# EAGLE design GW0015.v1.r02 (EAGLE 5.08)
MFGN: Tyco; MFGP: 9-103324-0
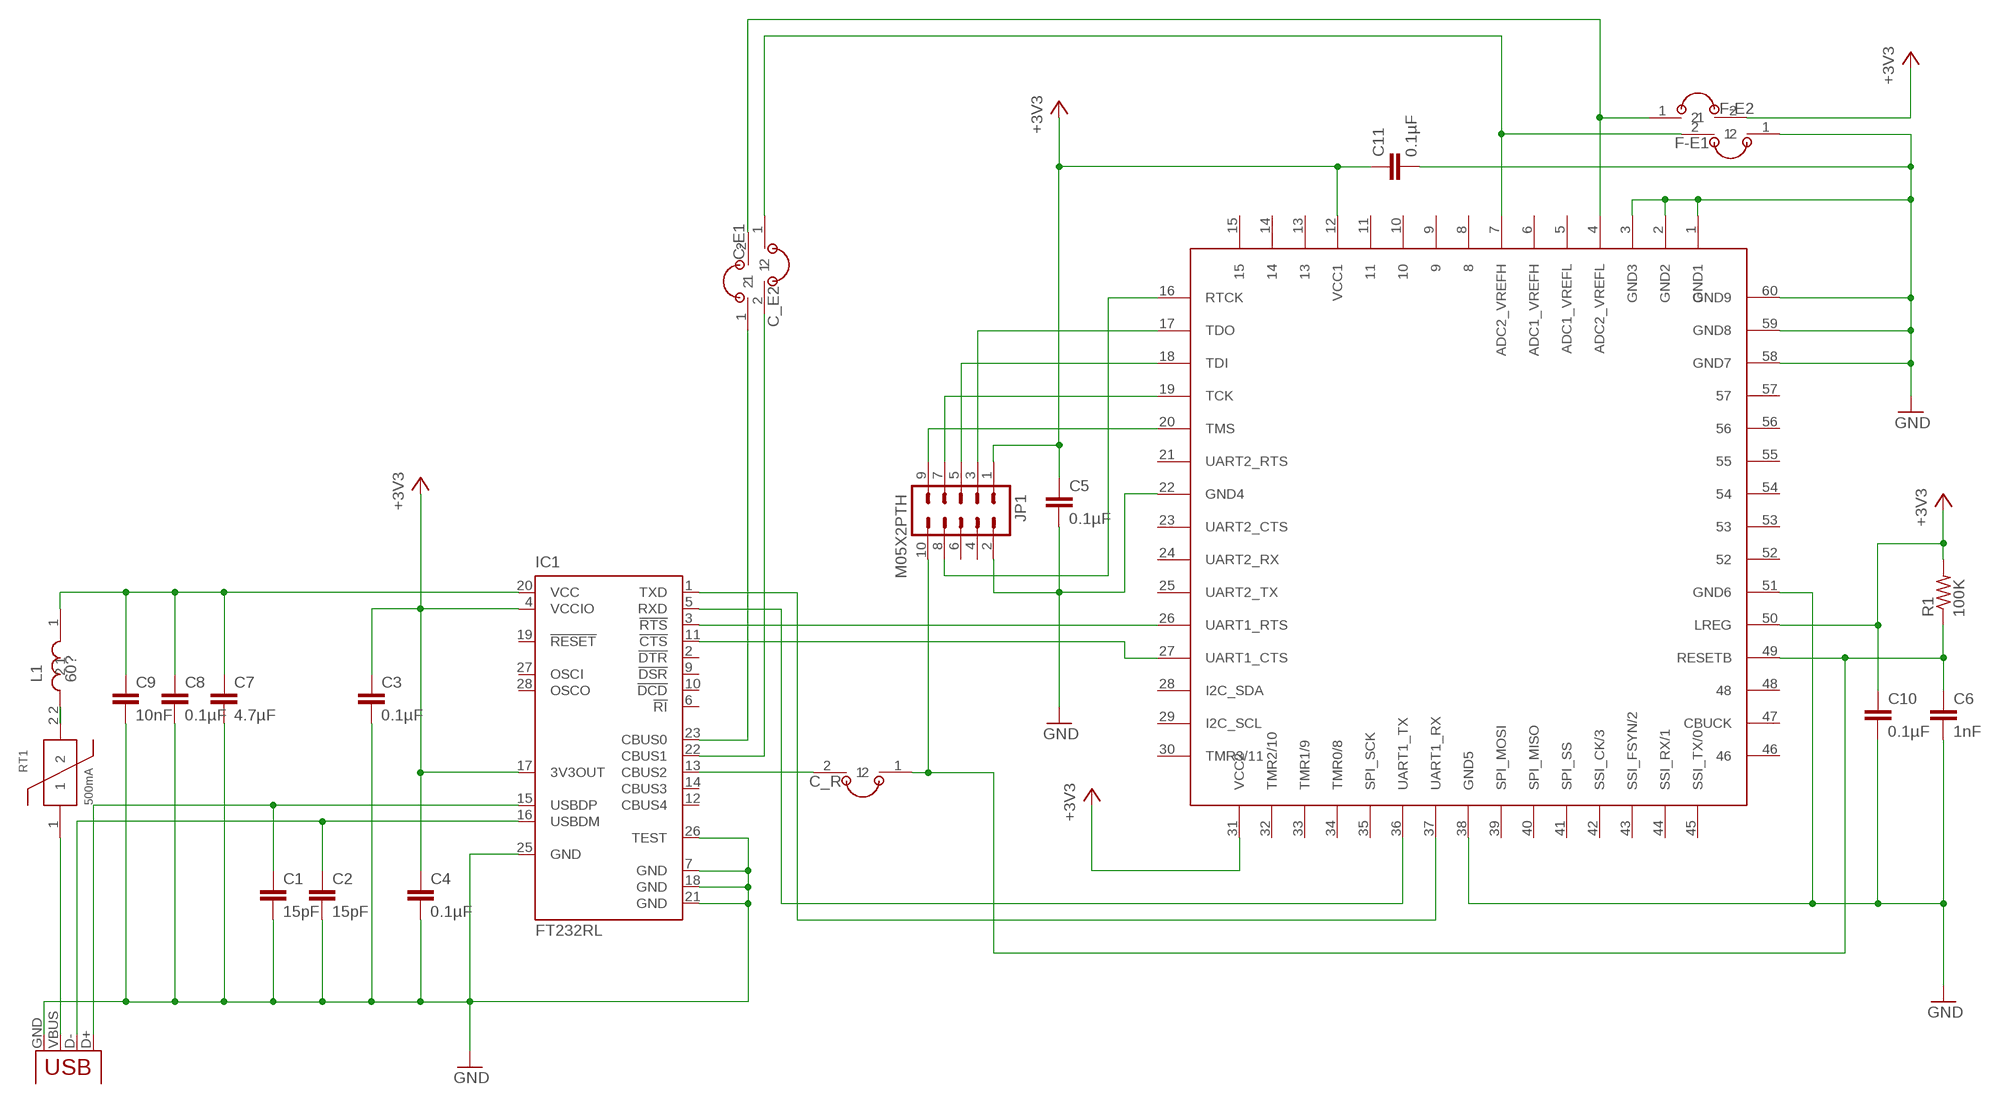
[diagram p0: schematic, sheet 1]

## Parts
C1  15pF  RF-C0402  [RF-C0402]
C2  15pF  RF-C0402  [RF-C0402]
C3  0.1µF  RF-C0402  [RF-C0402]
C4  0.1µF  RF-C0402  [RF-C0402]
C5  0.1µF  RF-C0402  [RF-C0402]
C6  1nF  RF-C0402  [RF-C0402]
C7  4.7µF  RF-C0805  [RF-C0805]
C8  0.1µF  RF-C0402  [RF-C0402]
C9  10nF  RF-C0402  [RF-C0402]
C10  0.1µF  RF-C0402  [RF-C0402]
C11  0.1µF  RF-C0402  [RF-C0402]
C-E1  JUMPER-2X-SMT-VIA  [JUMPER-VIA-2X]
C_E2  JUMPER-2X-SMT-VIA  [JUMPER-VIA-2X]
C_R  JUMPER-2X-SMT-VIA  [JUMPER-VIA-2X]
F-E1  JUMPER-2X-SMT-VIA  [JUMPER-VIA-2X]
F-E2  JUMPER-2X-SMT-VIA  [JUMPER-VIA-2X]
IC1  FT232RL  [SSOP28]
JP1  M05X2PTH  [AVR_ICSP]
L1  60?  RF-L0603  [RF-L0603]
R1  100K  RF-R0402  [RF-R0402]
RT1  500mA  SMD050F  [C1210]
U$1  ZSFM201-1A  [ZSFM201-1]
X1  USBPTH  [USB-B-PTH]

## Nets
+3V3: C3.1 C4.1 C5.1 C10.1 C11.1 F-E2.2 IC1.4(VCCIO) IC1.17(3V3OUT) JP1.1 R1.2 U$1.12(VCC1) U$1.31(VCC2) U$1.50(LREG)
GND [GND]: C1.2 C2.2 C3.2 C4.2 C5.2 C6.2 C7.2 C8.2 C9.2 C10.2 C11.2 F-E1.1 IC1.7(GND) IC1.18(GND) IC1.21(GND) IC1.25(GND) IC1.26(TEST) JP1.2 U$1.1(GND1) U$1.2(GND2) U$1.3(GND3) U$1.22(GND4) U$1.38(GND5) U$1.51(GND6) U$1.58(GND7) U$1.59(GND8) U$1.60(GND9) X1.GND
MCU_CTS: IC1.11(!CTS) U$1.27(UART1_CTS)
MCU_RTS: IC1.3(!RTS) U$1.26(UART1_RTS)
MCU_RX: IC1.1(TXD) U$1.37(UART1_RX)
MCU_TX: IC1.5(RXD) U$1.36(UART1_TX)
N$9: C-E1.2 F-E2.1 U$1.4(ADC2_VREFL)
N$10: C_E2.1 F-E1.2 U$1.7(ADC2_VREFH)
N$11: C-E1.1 IC1.23(CBUS0)
N$12: C_E2.2 IC1.22(CBUS1)
N$19: C_R.2 IC1.13(CBUS2)
RESET: C6.1 C_R.1 JP1.10 R1.1 U$1.49(RESETB)
RTCK: JP1.8 U$1.16(RTCK)
TCK: JP1.7 U$1.19(TCK)
TDI: JP1.5 U$1.18(TDI)
TDO: JP1.3 U$1.17(TDO)
TMS: JP1.9 U$1.20(TMS)
USB+: C1.1 IC1.15(USBDP) X1.D+
USB-: C2.1 IC1.16(USBDM) X1.D-
USB_VCC_1 [USB_VCC]: RT1.1 X1.VBUS
USB_VCC_2 [USB_VCC]: L1.2 RT1.2
USB_VCC_3 [USB_VCC]: C7.1 C8.1 C9.1 IC1.20(VCC) L1.1
Unconnected: IC1.2(!DTR) IC1.6(!RI) IC1.9(!DSR) IC1.10(!DCD) IC1.12(CBUS4) IC1.14(CBUS3) IC1.19(!RESET) IC1.27(OSCI) IC1.28(OSCO) JP1.4 JP1.6 U$1.5(ADC1_VREFL) U$1.6(ADC1_VREFH) U$1.8 U$1.9 U$1.10 U$1.11 U$1.13 U$1.14 U$1.15 U$1.21(UART2_RTS) U$1.23(UART2_CTS) U$1.24(UART2_RX) U$1.25(UART2_TX) U$1.28(I2C_SDA) U$1.29(I2C_SCL) U$1.30(TMR3/11) U$1.32(TMR2/10) U$1.33(TMR1/9) U$1.34(TMR0/8) U$1.35(SPI_SCK) U$1.39(SPI_MOSI) U$1.40(SPI_MISO) U$1.41(SPI_SS) U$1.42(SSI_CK/3) U$1.43(SSI_FSYN/2) U$1.44(SSI_RX/1) U$1.45(SSI_TX/0) U$1.46 U$1.47(CBUCK) U$1.48 U$1.52 U$1.53 U$1.54 U$1.55 U$1.56 U$1.57

## Library data of the parts
C1-C11 = GW-devices:RF-C: RF capacitor pads for FSL reference design
C-E1 C_E2 C_R F-E1 F-E2 = GW-devices:JUMPER-2X: This kind of jumper provides a place to place to put "green wires" for jumpering fetaure/options.
IC1 = ftdichip:FT232R: Source: http://www.ftdichip.com/Documents/DataSheets/DS_FT232R_v104.pdf
JP1 = SparkFun:M05X2: Header 5x2 Standard 10-pin dual row 0.1" header. Commonly used with AVR-ISP. Use with Spark Fun Electronics SKU: PRT-00778
L1 = GW-devices:RF-L: RF inductor pads for FSL reference design
R1 = GW-devices:RF-R: RF resistor pads for FSL reference design
RT1 = GW-devices:SMD050F: Tyco current limit switch
U$1 = GW-devices:ZSFM201-1: The CEL MC13224V
X1 = SparkFun:USB: USB Connectors USB-B-PTH is fully proven SKU : PRT-00139 USB-miniB is fully proven SKU : PRT-00587 USB-A-PCB is untested. USB-A-H is throughly reviewed, but untested. Spark Fun Electronics SKU : PRT-00437 USB-B-SMT is throughly reviewed, but untested. Needs silkscreen touching up. USB-A-S has not been used/tested USB-MB-H has not been used/tested

## Net classes
1 USB_VCC: width 0.4 mm
2 GND: width 0.3 mm

## Board
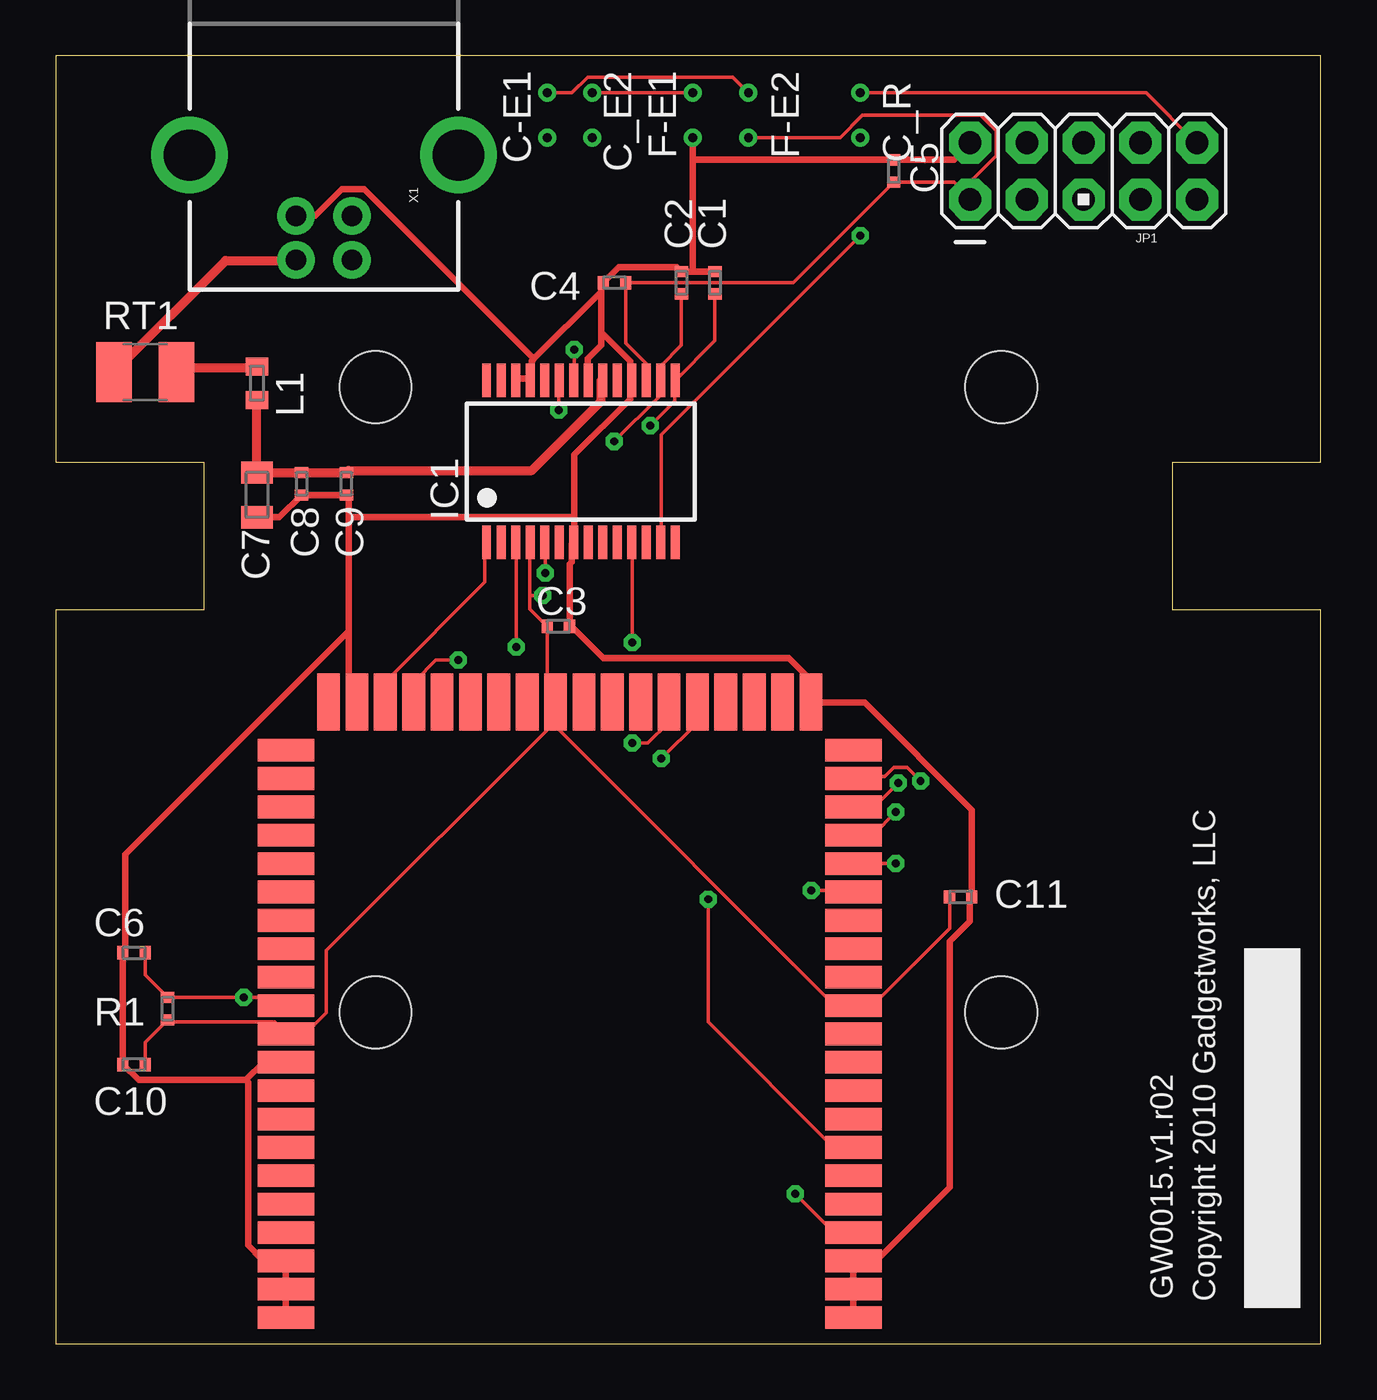
[diagram p1: board, top side]
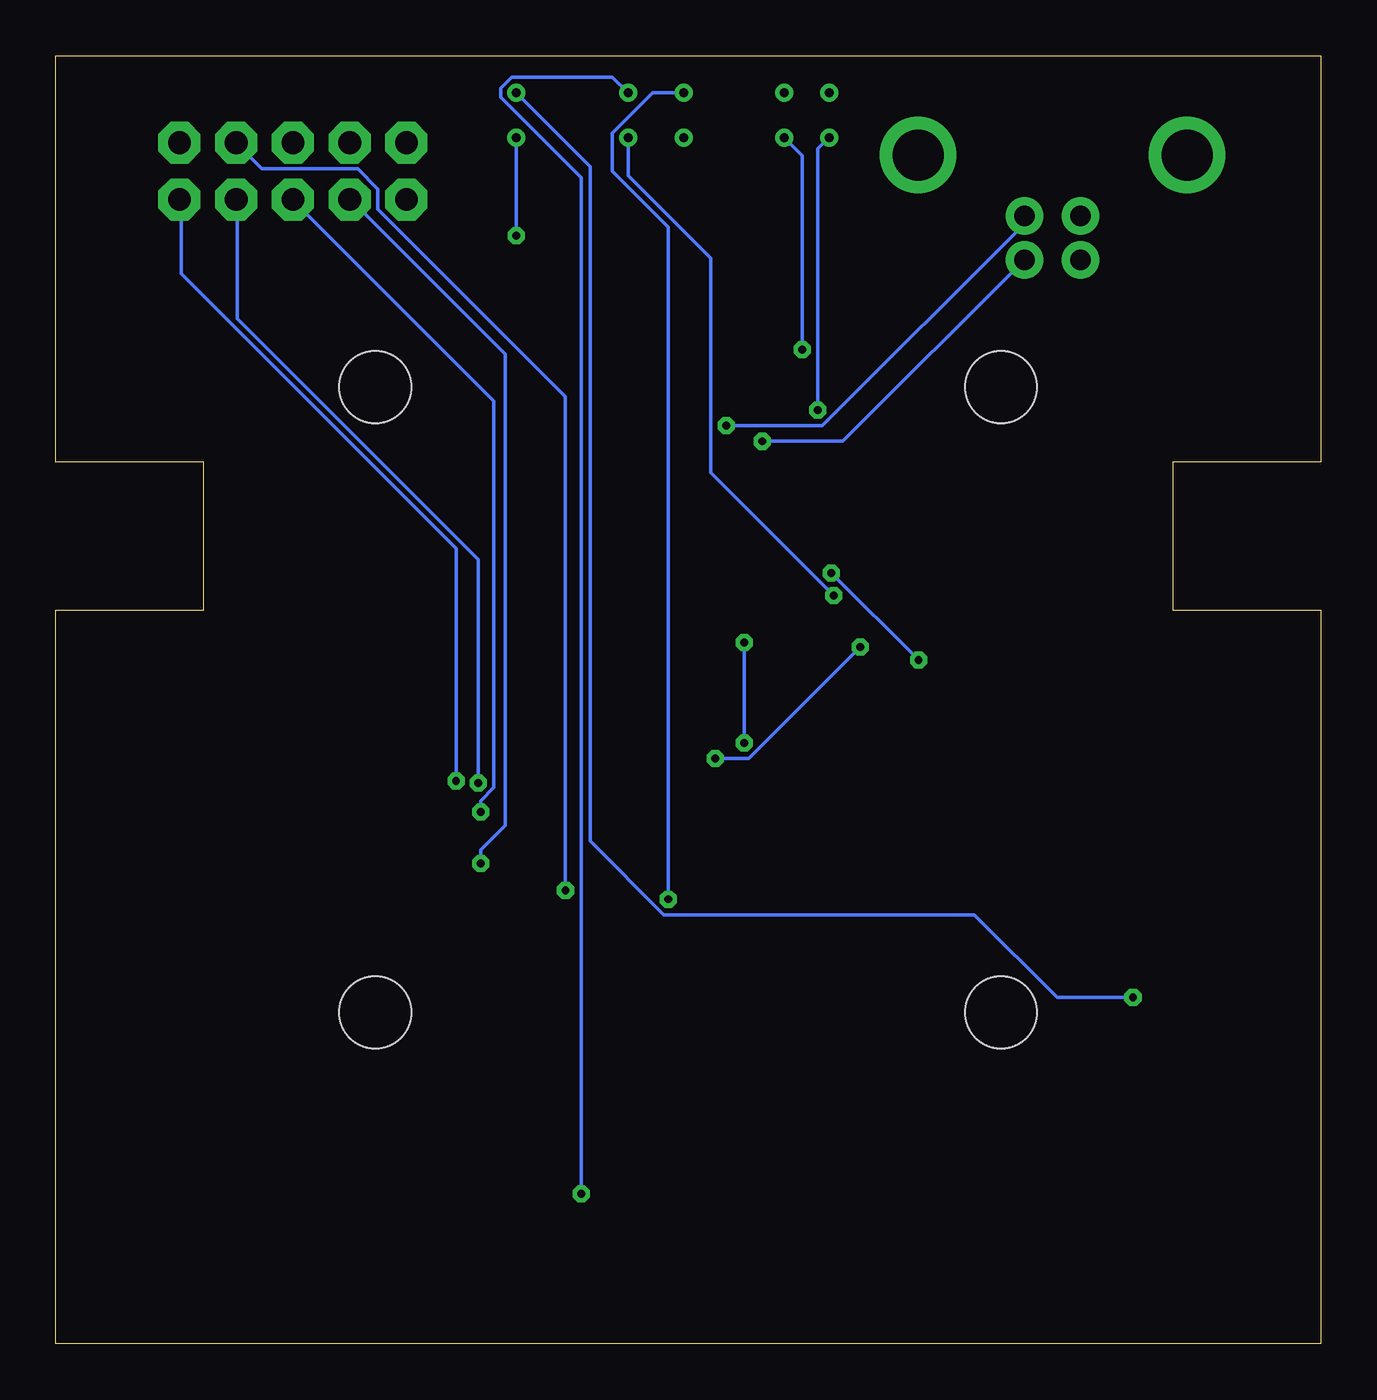
[diagram p2: board, bottom side, seen from below]

Size 56.61 x 57.66 mm. Coordinates in mm from the lower left corner, seen from the top.
Outline: 0,0 56.61,0 56.61,32.85 49.99,32.85 49.99,39.48 56.61,39.48 56.61,57.66 0,57.66 0,39.48 6.62,39.48 6.62,32.85 0,32.85 0,0
Copper layers (1*16): Top 0.0178mm / dielectric 1.4986mm / Bottom 0.0178mm
Design rules "SSC-EAGLE-2Lyr_v1.0.0.3": minimum track width 6mil, minimum drill 14mil, track to track 6mil, track to pad 6mil, pad to pad 6mil, via to via 6mil, smd to smd 6mil, copper to edge 20mil, drill to drill 16mil, minimum pad ring 8mil, minimum via ring 8mil, stop-mask expansion 3mil, vias tented up to drill 0mil, thermal gap 10mil
Holes 3.2 mm at 14.31,14.83 14.31,42.83 42.31,42.83 42.31,14.83

### Footprints (pad centres in the part's own frame; a part is rotated, then mirrored left to right if it is on the bottom)
RF-C0402 = smd 0.5 x 0.6: 1 -0.5,0; 2 0.5,0
RF-C0805 = smd 1 x 1.4: 1 -1,0; 2 1,0
JUMPER-VIA-2X = drill 0.4 round: 1 -1,0; 2 1,0
SSOP28 = smd 0.4 x 1.5: 1 -4.225,-3.625; 2 -3.575,-3.625; 3 -2.925,-3.625; 4 -2.275,-3.625; 5 -1.625,-3.625; 6 -0.975,-3.625; 7 -0.325,-3.625; 8 0.325,-3.625; 9 0.975,-3.625; 10 1.625,-3.625; 11 2.275,-3.625; 12 2.925,-3.625; 13 3.575,-3.625; 14 4.225,-3.625; 15 4.225,3.625; 16 3.575,3.625; 17 2.925,3.625; 18 2.275,3.625; 19 1.625,3.625; 20 0.975,3.625; 21 0.325,3.625; 22 -0.325,3.625; 23 -0.975,3.625; 24 -1.625,3.625; 25 -2.275,3.625; 26 -2.925,3.625; 27 -3.575,3.625; 28 -4.225,3.625
AVR_ICSP = drill 1.016 pad 1.88 octagon: 1 -1.27,5.08; 2 1.27,5.08; 3 -1.27,2.54; 4 1.27,2.54; 5 -1.27,0; 6 1.27,0; 7 -1.27,-2.54; 8 1.27,-2.54; 9 -1.27,-5.08; 10 1.27,-5.08
RF-L0603 = smd 0.8 x 1: 1 -0.75,0; 2 0.75,0
RF-R0402 = smd 0.5 x 0.6: 1 -0.5,0; 2 0.5,0
C1210 = smd 1.6 x 2.7: 1 -1.4,0; 2 1.4,0
ZSFM201-1 = smd 2.54 x 1.016: 1 -12.7,28.829; 2 -12.7,27.559; 3 -12.7,26.289; 4 -12.7,25.019; 5 -12.7,23.749; 6 -12.7,22.479; 7 -12.7,21.209; 8 -12.7,19.939; 9 -12.7,18.669; 10 -12.7,17.399; 11 -12.7,16.129; 12 -12.7,14.859; 13 -12.7,13.589; 14 -12.7,12.319; 15 -12.7,11.049; 16 -12.7,9.779; 17 -12.7,8.509; 18 -12.7,7.239; 19 -12.7,5.969; 20 -12.7,4.699; 21 -12.7,3.429; 40 12.7,3.429; 41 12.7,4.699; 42 12.7,5.969; 43 12.7,7.239; 44 12.7,8.509; 45 12.7,9.779; 46 12.7,11.049; 47 12.7,12.319; 48 12.7,13.589; 49 12.7,14.859; 50 12.7,16.129; 51 12.7,17.399; 52 12.7,18.669; 53 12.7,19.939; 54 12.7,21.209; 55 12.7,22.479; 56 12.7,23.749; 57 12.7,25.019; 58 12.7,26.289; 59 12.7,27.559; 60 12.7,28.829 | smd 1.016 x 2.54: 22 -10.795,1.27; 23 -9.525,1.27; 24 -8.255,1.27; 25 -6.985,1.27; 26 -5.715,1.27; 27 -4.445,1.27; 28 -3.175,1.27; 29 -1.905,1.27; 30 -0.635,1.27; 31 0.635,1.27; 32 1.905,1.27; 33 3.175,1.27; 34 4.445,1.27; 35 5.715,1.27; 36 6.985,1.27; 37 8.255,1.27; 38 9.525,1.27; 39 10.795,1.27
USB-B-PTH = drill 0.914 pad 1.676 round: D+ 0,1.25; D- 1.981,1.25; GND 0,-1.25; VBUS 1.981,-1.25 | drill 2.286 round: P$1 -2.718,-6.02; P$2 -2.718,6.02

### Placement (x,y rotation side)
C1  29.5,47.5 90 top
C2  28,47.5 90 top
C3  22.49,32.12 0 top
C4  25,47.5 180 top
C5  37.5,52.5 90 top
C6  3.5,17.5 180 top
C7  9,38 270 top
C8  11,38.5 270 top
C9  13,38.5 270 top
C10  3.5,12.5 180 top
C11  40.5,20 0 top
C-E1  22,55 90 top
C_E2  24,55 270 top
C_R  36,55 270 top
F-E1  28.5,55 90 top
F-E2  31,55 270 top
IC1  23.5,39.5 0 top
JP1  46,52.5 90 top
L1  9,43 90 top
R1  5,15 270 top
RT1  4,43.5 0 top
U$1  23,30 180 top
X1  12,50.5 270 top

### Tracks (layer width: path | path; a pad name or v marks a point on that pad's centre or on a via)
+3V3  (via drill 0.36)
  Top 0.152: IC1.17 26.4,43.2 26.4,43.9 25.5,44.8 C4.1 33,47.5 C5.1 40.2,52 40.9,51.3 JP1.1 40.6,51.7 42.1,53.2 42.1,54.3 41.4,55 36.1,55 35.1,54 F-E2.2 | C11.1 40,18.6 36.6,15.2 35.7,15.2 | C10.1 4,13.5 R1.2 5,14.4 9.8,14.4 10.3,13.9 U$1.50 10.3,14 11.3,14 12.1,14.8 12.1,17.6 22.3,27.8 22.3,28.7 U$1.31 | U$1.31 22.3,28.8 22,29.1 22,32.1 C3.1 21.9,32.2 21.2,32.9 21.2,33.5 | 21.2,33.5 21.2,35.8 IC1.4 | 35.7,15.2 34.8,15.2 22.3,27.7 U$1.31 | 35.7,15.2 U$1.12 | 21.2,33.5 v21.8,33.5
  Bottom 0.152: F-E2.2 31,52.3 27.3,48.6 27.3,39 v21.8,33.5
GND
  Top 0.3: U$1.1 U$1.2 U$1.3 35.8,3.8 36.8,3.8 40,7 40,18 40.9,18.9 40.9,19.9 C11.2 41,23.9 36.2,28.7 33.8,28.7 U$1.22 33.7,28.8 33.7,29.8 32.8,30.7 24.5,30.7 23.1,32.1 C3.2 23,32.2 23,34.9 23.1,35 23.1,35.8 IC1.7 23.2,36 23.2,37 | U$1.60 U$1.59 U$1.58 10.2,3.8 9.2,3.8 8.6,4.4 8.6,11.7 8.5,11.8 | 8.5,11.8 3.7,11.8 C10.2 C6.2 3.1,17.6 3.1,21.9 13,31.8 13.1,31.8 | 8.5,11.8 9.3,12.6 U$1.51 | 13.1,31.8 13.1,29.1 13.4,28.8 U$1.38 | 13.1,31.8 13.1,37 | 13.1,37 13.1,37.9 C9.2 C8.2 10,37 C7.2 | JP1.2 40.9,53.7 40.2,53 C5.2 28.5,53 | IC1.26 20.6,43.2 21.2,43.2 IC1.25 21.3,43.3 21.3,44 21.4,44.1 | 28.5,48 C1.2 | 28.5,48 C2.2 27.8,48.2 25.2,48.2 C4.2 24.4,47.4 24.4,47 | 24.4,45.2 24.4,47 | 24.4,45.2 24.4,44.7 23.8,44.1 23.8,43.2 IC1.21 | 24.4,45.2 24.5,45.2 25.7,44 25.7,43.2 IC1.18 25.7,43 25.7,42.3 23.2,39.8 23.2,37 | 28.5,53 F-E1.1 | 28.5,48 28.5,53 | 21.4,44.1 24.3,47 24.4,47 | X1.GND 11.6,50.5 12.8,51.7 13.8,51.7 21.4,44.1 | 13.1,37 23.2,37
MCU_CTS  (via drill 0.36)
  Top 0.152: v25.8,31.4 25.8,35.8 IC1.11 | v25.8,26.9 26.5,26.9 27.4,27.8 27.4,28.7 U$1.27
  Bottom 0.152: v25.8,26.9 v25.8,31.4
MCU_RTS  (via drill 0.36)
  Top 0.152: v20.6,31.2 20.6,35.8 IC1.3 | v27.1,26.2 28.7,27.8 28.7,28.7 U$1.26
  Bottom 0.152: v20.6,31.2 25.6,26.2 v27.1,26.2
MCU_RX
  Top 0.152: IC1.1 19.2,35.8 19.2,34.1 14.8,29.7 14.8,28.8 U$1.37
MCU_TX  (via drill 0.36)
  Top 0.152: v21.9,34.5 21.9,35.8 IC1.5 | v18,30.6 17,30.6 16.1,29.7 16.1,28.8 U$1.36
  Bottom 0.152: v18,30.6 v21.9,34.5
N$9  (via drill 0.36)
  Top 0.152: C-E1.2 23.1,56 23.8,56.7 30.3,56.7 F-E2.1 | v33.1,6.7 34.8,5 35.7,5 U$1.4
  Bottom 0.152: v33.1,6.7 33.1,52.2 36.7,55.8 36.7,56.2 36.2,56.7 31.7,56.7 F-E2.1
N$10  (via drill 0.36)
  Top 0.152: F-E1.2 C_E2.1 | v29.2,19.9 29.2,14.4 34.8,8.8 U$1.7
  Bottom 0.152: v29.2,19.9 29.2,50 31.7,52.5 31.7,54.2 29.9,56 F-E1.2
N$11  (via drill 0.36)
  Top 0.152: v22.5,41.8 22.5,43.1 IC1.23
  Bottom 0.152: v22.5,41.8 22.5,53.5 C-E1.1
N$12  (via drill 0.36)
  Top 0.152: v23.2,44.5 23.2,43.2 IC1.22
  Bottom 0.152: v23.2,44.5 23.2,53.2 C_E2.2
N$19  (via drill 0.36)
  Top 0.152: v36,49.6 27.1,40.7 27.1,35.9 IC1.13
  Bottom 0.152: v36,49.6 C_R.2
RESET  (via drill 0.36)
  Top 0.152: C6.1 4,16.5 R1.1 v8.4,15.5 10,15.5 10.3,15.2 U$1.49 | C_R.1 48.8,56 51,53.8 JP1.10
  Bottom 0.152: v8.4,15.5 11.8,15.5 15.5,19.2 29.4,19.2 32.7,22.5 32.7,52.7 C_R.1
RTCK  (via drill 0.36)
  Top 0.152: v33.8,20.3 35.7,20.3 U$1.16
  Bottom 0.152: v33.8,20.3 33.8,42.4 42.2,50.8 42.2,51.7 43.1,52.6 47.4,52.6 48.5,53.7 JP1.8
TCK  (via drill 0.36)
  Top 0.152: v37.7,25.1 36.7,24.1 35.7,24.1 U$1.19
  Bottom 0.152: v37.7,25.1 37.7,35.1 48.5,45.9 48.5,51.2 JP1.7
TDI  (via drill 0.36)
  Top 0.152: v37.6,23.8 36.6,22.8 35.7,22.8 U$1.18
  Bottom 0.152: v37.6,23.8 37.6,24.3 37,24.9 37,42.2 46,51.2 JP1.5
TDO  (via drill 0.36)
  Top 0.152: v37.6,21.5 U$1.17
  Bottom 0.152: v37.6,21.5 37.6,22.1 36.5,23.2 36.5,44.3 43.4,51.2 JP1.3
TMS  (via drill 0.36)
  Top 0.152: v38.7,25.2 38.1,25.8 37.5,25.8 37.1,25.4 35.7,25.4 U$1.20
  Bottom 0.152: v38.7,25.2 38.7,35.6 51,47.9 51,51.2 JP1.9
USB+  (via drill 0.36)
  Top 0.152: C1.1 29.5,44.9 IC1.15 27.7,43.1 27.7,42.2 v26.6,41.1
  Bottom 0.152: v26.6,41.1 22.3,41.1 13.3,50.1 13.3,50.5 X1.D+
USB-  (via drill 0.36)
  Top 0.152: C2.1 28,44.7 27.1,43.8 27.1,43.2 IC1.16 27,43.1 27,42.4 v25,40.4
  Bottom 0.152: v25,40.4 21.4,40.4 13.3,48.5 X1.D-
USB_VCC_1
  Top 0.4: RT1.1 7.6,48.5 10.7,48.5 X1.VBUS
USB_VCC_2
  Top 0.4: RT1.2 5.6,43.7 9,43.7 L1.2
USB_VCC_3
  Top 0.4: L1.1 C7.1 C8.1 C9.1 13.1,39.1 21.3,39.1 24.4,42.2 24.4,43.1 IC1.20

### Text on the board
tNames: GW0015.v1.r02 | Copyright 2010 Gadgetworks, LLC